# EAGLE design RoboCore Light sensor bar (EAGLE 9.6.2)
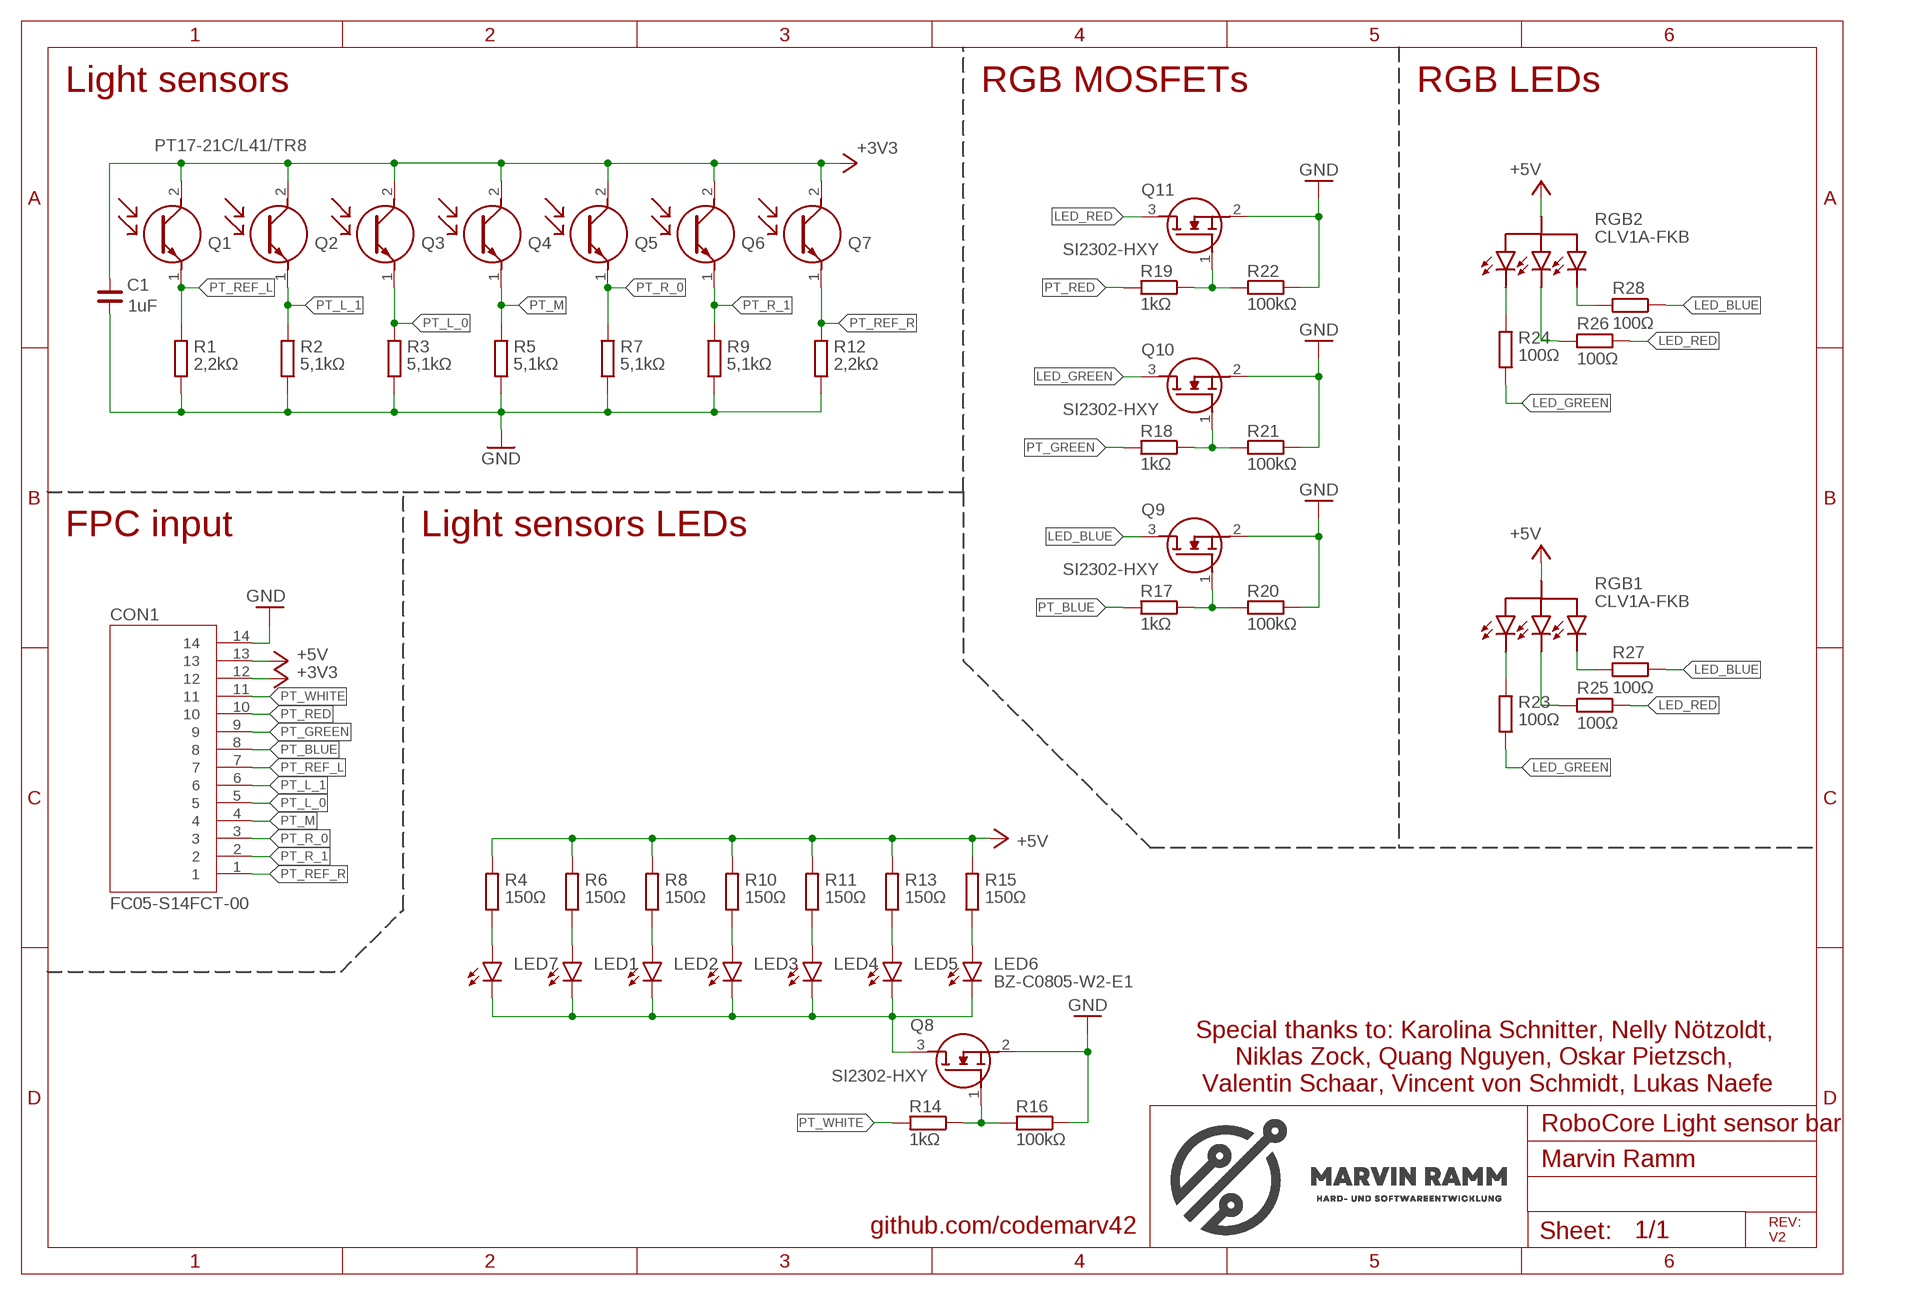
[diagram p0: schematic, sheet 1]

## Parts
C1  1uF  C_0402  [C0402]
CON1  FC05-S14FCT-00  [FC05-S14FCT-00]
LED1  LEDCHIP-LED0805  [CHIP-LED0805]
LED2  LEDCHIP-LED0805  [CHIP-LED0805]
LED3  LEDCHIP-LED0805  [CHIP-LED0805]
LED4  LEDCHIP-LED0805  [CHIP-LED0805]
LED5  LEDCHIP-LED0805  [CHIP-LED0805]
LED6  LEDCHIP-LED0805  [CHIP-LED0805]
LED7  LEDCHIP-LED0805  [CHIP-LED0805]
Q1  PT17-21C/L41/TR8  [0805]
Q2  PT17-21C/L41/TR8  [0805]
Q3  PT17-21C/L41/TR8  [0805]
Q4  PT17-21C/L41/TR8  [0805]
Q5  PT17-21C/L41/TR8  [0805]
Q6  PT17-21C/L41/TR8  [0805]
Q7  PT17-21C/L41/TR8  [0805]
Q8  SI2302DDS-T1-GE3  [SOT95P237X112-3N]
Q9  SI2302DDS-T1-GE3  [SOT95P237X112-3N]
Q10  SI2302DDS-T1-GE3  [SOT95P237X112-3N]
Q11  SI2302DDS-T1-GE3  [SOT95P237X112-3N]
R1  2,2kΩ  R_0402  [R0402]
R2  5,1kΩ  R_0402  [R0402]
R3  5,1kΩ  R_0402  [R0402]
R4  150Ω  R_0402  [R0402]
R5  5,1kΩ  R_0402  [R0402]
R6  150Ω  R_0402  [R0402]
R7  5,1kΩ  R_0402  [R0402]
R8  150Ω  R_0402  [R0402]
R9  5,1kΩ  R_0402  [R0402]
R10  150Ω  R_0402  [R0402]
R11  150Ω  R_0402  [R0402]
R12  2,2kΩ  R_0402  [R0402]
R13  150Ω  R_0402  [R0402]
R14  1kΩ  R_0402  [R0402]
R15  150Ω  R_0402  [R0402]
R16  100kΩ  R_0402  [R0402]
R17  1kΩ  R_0402  [R0402]
R18  1kΩ  R_0402  [R0402]
R19  1kΩ  R_0402  [R0402]
R20  100kΩ  R_0402  [R0402]
R21  100kΩ  R_0402  [R0402]
R22  100kΩ  R_0402  [R0402]
R23  100Ω  R_0402  [R0402]
R24  100Ω  R_0402  [R0402]
R25  100Ω  R_0402  [R0402]
R26  100Ω  R_0402  [R0402]
R27  100Ω  R_0402  [R0402]
R28  100Ω  R_0402  [R0402]
RGB1  RGBLED  [RGBLED]
RGB2  RGBLED  [RGBLED]

## Nets
+3V3: C1.2 CON1.12 Q1.2(C) Q2.2(C) Q3.2(C) Q4.2(C) Q5.2(C) Q6.2(C) Q7.2(C)
+5V: CON1.13 R4.1 R6.1 R8.1 R10.1 R11.1 R13.1 R15.1 RGB1.+5V RGB2.+5V
GND: C1.1 CON1.14 Q8.2(S) Q9.2(S) Q10.2(S) Q11.2(S) R1.2 R2.2 R3.2 R5.2 R7.2 R9.2 R12.2 R16.2 R20.2 R21.2 R22.2
LED_BLUE: Q9.3(D) R27.2 R28.2
LED_GREEN: Q10.3(D) R23.2 R24.2
LED_RED: Q11.3(D) R25.2 R26.2
N$1: LED1.C LED2.C LED3.C LED4.C LED5.C LED6.C LED7.C Q8.3(D)
N$2: LED7.A R4.2
N$3: Q11.1(G) R19.2 R22.1
N$4: Q10.1(G) R18.2 R21.1
N$5: Q9.1(G) R17.2 R20.1
N$14: LED5.A R13.2
N$15: LED6.A R15.2
N$17: Q8.1(G) R14.2 R16.1
N$18: LED4.A R11.2
N$45: R24.1 RGB2.P3
N$46: R28.1 RGB2.P1
N$47: R26.1 RGB2.P2
N$50: R23.1 RGB1.P3
N$51: R27.1 RGB1.P1
N$52: R25.1 RGB1.P2
N$53: LED3.A R10.2
N$54: LED2.A R8.2
N$55: LED1.A R6.2
PT_BLUE: CON1.8 R17.1
PT_GREEN: CON1.9 R18.1
PT_L_0: CON1.5 Q3.1(E) R3.1
PT_L_1: CON1.6 Q2.1(E) R2.1
PT_M: CON1.4 Q4.1(E) R5.1
PT_R_0: CON1.3 Q5.1(E) R7.1
PT_R_1: CON1.2 Q6.1(E) R9.1
PT_RED: CON1.10 R19.1
PT_REF_L: CON1.7 Q1.1(E) R1.1
PT_REF_R: CON1.1 Q7.1(E) R12.1
PT_WHITE: CON1.11 R14.1

## Notes on the sheet
- Light sensors | RGB MOSFETs | RGB LEDs
- RGB2
- SI2302-HXY | CLV1A-FKB
- SI2302-HXY
- FPC input | Light sensors LEDs
- SI2302-HXY
- RGB1
- CLV1A-FKB
- BZ-C0805-W2-E1
- Special thanks to: Karolina Schnitter, Nelly Nötzoldt, 
  Niklas Zock, Quang Nguyen, Oskar Pietzsch, 
  Valentin Schaar, Vincent von Schmidt, Lukas Naefe
- SI2302-HXY
- Marvin Ramm
- github.com/codemarv42
- REV:
  V2

## Library data of the parts
C1 = rc-master-smd:C_: NON-POLARIZED CAP
CON1 = FC05-S14FCT-00:FC05-S14FCT-00
LED1-LED7 = Led:LED: LED OSRAM: - CHIPLED LG R971, LG N971, LY N971, LG Q971, LY Q971, LO R971, LY R971 LH N974, LH R974 LS Q976, LO Q976, LY Q976 LO Q996 - Hyper CHIPLED LW Q18S LB Q993, LB Q99A, LB R99A - SideLED LS A670, LO A670, LY A670, LG A670, LP A670 LB A673, LV A673, LT A673, LW A673 LH A674 LY A675 LS A676, LA A676, LO A676, LY A676, LW A676 LS A679, LY A679, LG A679 - Hyper Micro SIDELED® LS Y876, LA Y876, LO Y876, LY Y876 LT Y87S - SmartLED LW L88C, LW L88S LB L89C, LB L89S, LG L890 LS L89K, LO L89K, LY L89K LS L896, LA L896, LO L896, LY L896 - TOPLED LS T670, LO T670, LY T670, LG T670, LP T670 LSG T670, LSP T670, LSY T670, LOP T670, LYG T670 LG T671, LOG T671, LSG T671 LB T673, LV T673, LT T673, LW T673 LH T674 LS T676, LA T676, LO T676, LY T676, LB T676, LH T676, LSB T676, LW T676 LB T67C, LV T67C, LT T67C, LS T67K, LO T67K, LY T67K, LW E67C LS E67B, LA E67B, LO E67B, LY E67B, LB E67C, LV E67C, LT E67C LW T67C LS T679, LY T679, LG T679 LS T770, LO T770, LY T770, LG T770, LP T770 LB T773, LV T773, LT T773, LW T773 LH T774 LS E675, LA E675, LY E675, LS T675 LS T776, LA T776, LO T776, LY T776, LB T776 LHGB T686 LT T68C, LB T68C - Hyper Mini TOPLED® LB M676 - Mini TOPLED Santana® LG M470 LS M47K, LO M47K, LY M47K Source: http://www.osram.convergy.de LUXEON: - LUMILED® LXK2-PW12-R00, LXK2-PW12-S00, LXK2-PW14-U00, LXK2-PW14-V00 LXK2-PM12-R00, LXK2-PM12-S00, LXK2-PM14-U00 LXK2-PE12-Q00, LXK2-PE12-R00, LXK2-PE12-S00, LXK2-PE14-T00, LXK2-PE14-U00 LXK2-PB12-K00, LXK2-PB12-L00, LXK2-PB12-M00, LXK2-PB14-N00, LXK2-PB14-P00, LXK2-PB14-Q00 LXK2-PR12-L00, LXK2-PR12-M00, LXK2-PR14-Q00, LXK2-PR14-R00 LXK2-PD12-Q00, LXK2-PD12-R00, LXK2-PD12-S00 LXK2-PH12-R00, LXK2-PH12-S00 LXK2-PL12-P00, LXK2-PL12-Q00, LXK2-PL12-R00 Source: www.luxeon.com KINGBRIGHT: KA-3528ASYC Source: www.kingbright.com
Q1-Q7 = Eigene Library:PT17-21C/L41/TR8
Q8-Q11 = SI2302DDS-T1-GE3:SI2302DDS-T1-GE3: SI2302DDS-T1-GE3 N-Channel MOSFET, 2.6 A, 20 V, 3-Pin SOT-363 Vishay Source: Datasheet <http://www.vishay.com/docs/63653/si2302dds.pdf>; ARROW_PART_NUMBER: SI2302DDS-T1-GE3; ARROW_PRICE-STOCK: https://www.arrow.com/en/products/si2302dds-t1-ge3/vishay; DESCRIPTION: SI2302DDS-T1-GE3 N-Channel MOSFET, 2.6 A, 20 V, 3-Pin SOT-363 Vishay; HEIGHT: 1.12mm; MANUFACTURER_NAME: Vishay; MANUFACTURER_PART_NUMBER: SI2302DDS-T1-GE3; MOUSER_PART_NUMBER: 78-SI2302DDS-T1-GE3; MOUSER_PRICE-STOCK: https://www.mouser.co.uk/ProductDetail/Vishay-Semiconductors/SI2302DDS-T1-GE3?qs=MxnWX8BLHKdaCSNWhg%252BxLA%3D%3D
R1-R28 = rc-master-smd:R_: RESISTOR
RGB1 RGB2 = RGB LED:RGBLED

## Board
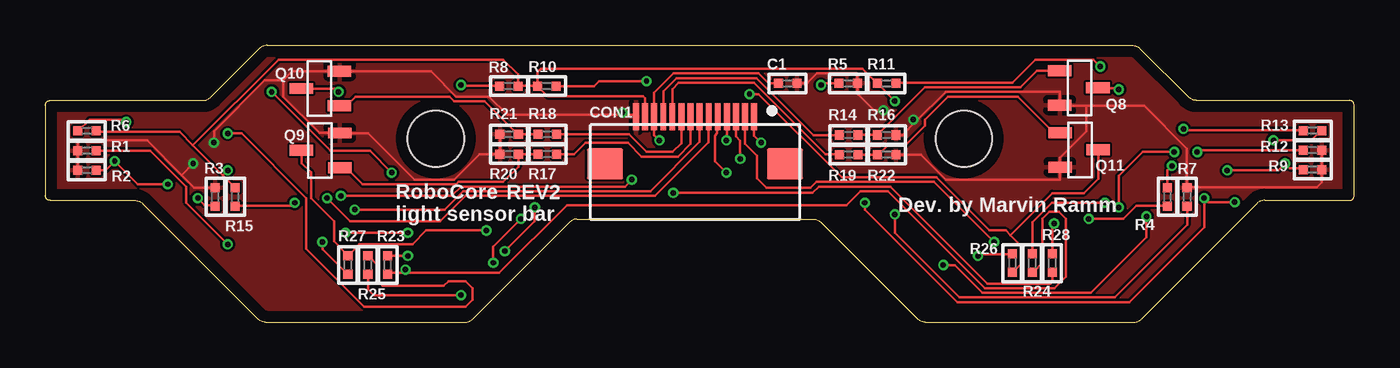
[diagram p1: board, top side]
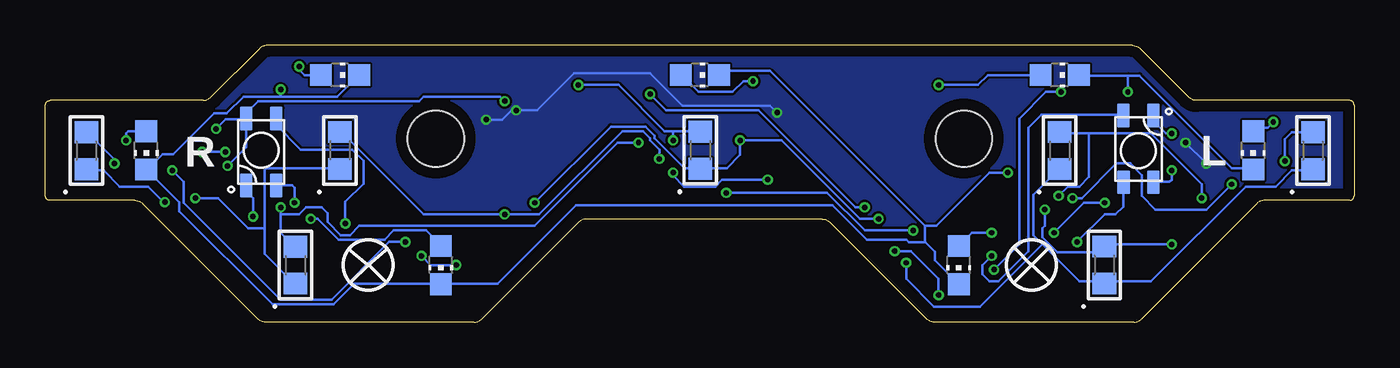
[diagram p2: board, bottom side, seen from below]

Size 72 x 15.23 mm. Coordinates in mm from the lower left corner, seen from the top.
Outline: 72,6.95 72,11.95 arc90 71.75,12.2 63.33,12.2 arc-45 62.9,12.38 60.23,15.05 arc45 59.8,15.23 12.2,15.23 arc37 11.82,15.1 9.1,12.38 arc-45 8.68,12.2 0.25,12.2 arc90 0,11.95 0,6.95 arc90 0.25,6.7 4.92,6.7 arc-45 5.35,6.52 11.7,0.17 arc45 12.12,0 23.07,0 arc45 23.5,0.17 28.82,5.5 arc-45 29.25,5.67 42.25,5.67 arc-45 42.67,5.5 48,0.17 arc45 48.42,0 59.88,0 arc45 60.3,0.17 66.65,6.52 arc-45 67.08,6.7 71.75,6.7 arc90 72,6.95
Copper layers (1*16): Top 0.035mm / dielectric 1.53mm / Bottom 0.035mm
Design rules "JLCPCB_1-2layer *": minimum track width 5mil, minimum drill 0.3mm, track to track 5mil, track to pad 0.2mm, pad to pad 7mil, via to via 7mil, smd to smd 7mil, copper to edge 25mil, drill to drill 6mil, minimum pad ring 6mil, minimum via ring 0.13mm, stop-mask expansion 0.1mm, vias tented up to drill 20mil, thermal gap 10mil
Holes 3.1 mm at 21.48,10.1 50.52,10.1

### Footprints (pad centres in the part's own frame; a part is rotated, then mirrored left to right if it is on the bottom)
C0402 = smd 0.5 x 0.5: 1 -0.508,0; 2 0.508,0
FC05-S14FCT-00 = smd 0.32 x 1.5: 1 2.51,-0.45; 2 3.01,-0.45; 3 3.51,-0.45; 4 4.01,-0.45; 5 4.51,-0.45; 6 5.01,-0.45; 7 5.51,-0.45; 8 6.01,-0.45; 9 6.51,-0.45; 10 7.01,-0.45; 11 7.51,-0.45; 12 8.01,-0.45; 13 8.51,-0.45; 14 9.01,-0.45 | smd 2 x 1.7: PAD1 0.81,2.15; PAD2 10.71,2.15
CHIP-LED0805 = smd 1.2 x 1.2: A 0,-1.05; C 0,1.05
0805 = smd 1.2 x 1.3: 1 -1.016,0; 2 1.016,0
SOT95P237X112-3N = smd 1.3 x 0.6: 1 -1.05,0.95; 2 -1.05,-0.95; 3 1.05,0
R0402 = smd 0.5 x 0.5: 1 -0.508,0; 2 0.508,0
RGBLED = smd 0.686 x 1.3: +5V -1.456,1.996; P1 0.184,1.996; P2 -1.458,-1.678; P3 0.192,-1.678

### Placement (x,y rotation side)
C1  40.83,13.14 180 top
CON1  41.5,10.86 180 top
LED1  5.55,9.45 180 bottom
LED2  16.2,13.6 270 bottom
LED3  36,13.6 270 bottom
LED4  55.8,13.6 270 bottom
LED5  66.45,9.45 180 bottom
LED6  21.75,3.15 180 bottom
LED7  50.25,3.15 180 bottom
Q1  13.74,3.15 270 bottom
Q2  2.27,9.44 270 bottom
Q3  16.2,9.45 270 bottom
Q4  35.97,9.46 270 bottom
Q5  55.8,9.45 270 bottom
Q6  69.75,9.44 270 bottom
Q7  58.24,3.14 270 bottom
Q8  56.85,12.89 0 top
Q9  15.14,9.46 180 top
Q10  15.13,12.86 180 top
Q11  56.87,9.48 0 top
R1  2.28,9.44 180 top
R2  2.28,8.36 180 top
R3  9.34,6.9 90 top
R4  61.73,6.9 270 top
R5  44.16,13.14 0 top
R6  2.28,10.53 180 top
R7  62.81,6.9 90 top
R8  25.5,12.99 180 top
R9  69.72,8.4 0 top
R10  27.59,12.99 0 top
R11  46.28,13.14 0 top
R12  69.72,9.47 0 top
R13  69.72,10.54 0 top
R14  44.19,10.3 0 top
R15  10.44,6.9 270 top
R16  46.29,10.3 0 top
R17  27.62,9.25 180 top
R18  27.62,10.34 180 top
R19  44.19,9.22 0 top
R20  25.51,9.25 180 top
R21  25.51,10.34 180 top
R22  46.29,9.22 0 top
R23  18.83,3.15 270 top
R24  54.29,3.25 270 top
R25  17.74,3.15 270 top
R26  53.2,3.25 270 top
R27  16.64,3.15 90 top
R28  55.39,3.25 270 top
RGB1  12.49,9.7 180 bottom
RGB2  59.49,9.2 0 bottom

### Tracks (layer width: path | path; a pad name or v marks a point on that pad's centre or on a via)
+3V3  (via drill 0.3)
  Top 0.127: C1.2 39.78,13.15 39.24,13.69 34.55,13.69 33.49,12.63 CON1.12 33.49,10.3 v33.78,10 | v65.43,6.61 63.97,6.61 v63.75,6.83 63.75,5.23 59.64,1.11 50.16,1.11 45.09,6.19 v45.09,6.58 | v24.64,3.27 24.64,4.16 v26.16,5.69
  Bottom 0.127: 17.14,4.29 17.65,4.8 17.65,7 16.23,8.43 Q3.2 | 17.14,4.29 15.11,2.26 13.84,2.26 Q1.2 13.72,2.26 11.18,2.26 5.97,7.46 4.32,7.46 3.43,8.35 2.29,8.35 Q2.2 | 59.94,5.18 59.94,3.77 58.31,2.13 Q7.2 | 59.94,5.18 59.94,8.36 59.82,8.48 55.88,8.48 Q5.2 | v65.43,6.61 65.5,6.61 66.35,7.46 67.91,7.46 68.8,8.35 69.72,8.35 Q6.2 | v63.75,6.83 62.48,6.83 60.83,5.18 59.94,5.18 | v45.09,6.58 40.89,10.77 38.99,10.77 38.48,10.26 38.48,10.13 36.83,8.48 36.07,8.48 Q4.2 35.94,8.48 34.51,8.48 33.78,9.2 v33.78,10 31.5,10 27.18,5.69 v26.16,5.69 | 17.14,4.29 20.57,0.86 23.11,0.86 24.64,2.38 v24.64,3.27
+5V  (via drill 0.3)
  Top 0.127: v61.98,8.61 61.73,8.36 R4.1 | v62.61,10.64 62.69,10.56 69.1,10.56 69.09,10.54 R13.1 | 8.11,9.73 7.37,10.48 2.83,10.48 2.79,10.51 R6.1 | 9.76,8.09 8.11,9.73 | R15.1 9.76,8.08 9.76,8.09 | 9.76,8.09 v10.03,8.35 | R10.1 R8.1 26.01,13.63 25.19,14.45 12.83,14.45 8.11,9.73 | R10.1 27.08,13.77 27.26,13.94 44.96,13.94 45.72,13.18 R11.1 45.85,13.05 v46.74,12.16 | R10.1 27.08,12.98 27.61,12.45 32.88,12.45 32.99,12.33 CON1.13
  Bottom 0.127: v61.98,8.61 60.96,9.62 60.96,10.64 | 60.96,10.64 60.96,11.15 RGB2.+5V | v62.61,10.64 62.08,11.17 60.95,11.17 | 60.96,10.64 60.95,11.17 | 60.95,11.17 RGB2.+5V | v10.03,8.35 10.03,7.84 10.15,7.72 10.92,7.72 RGB1.+5V | RGB2.+5V 60.95,11.52 60.3,12.16 51.44,12.16 51.18,12.42 46.99,12.42 v46.74,12.16
GND  (via drill 0.3)
  Top 0.127: R22.2 48.16,9.22 49.53,7.84 55.82,7.84 Q11.2 55.82,9.06 57.27,10.51 57.27,11.91 | R12.2 70.23,9.37 70.23,8.48 R9.2 70.23,7.69 69.96,7.42 62.88,7.42 62.87,7.41 R7.2 62.81,9.55 60.45,11.91 57.27,11.91 | C1.1 41.91,13.14 42.46,13.69 44.63,13.69 44.67,13.65 R5.2 44.67,12.57 45.58,11.66 v46.1,11.66 | R16.2 47.16,10.3 47.88,11.02 | 47.88,11.02 49.53,12.67 55.8,12.67 Q8.2 55.88,11.91 57.27,11.91 | 47.88,11.02 v47.75,11.15 | R2.2 1.77,8.38 1.77,9.43 R1.2 1.77,9.88 1.89,10 5.59,10 7.49,8.1 | R3.2 8.18,7.41 7.49,8.1 | R21.2 25.02,10.26 25.02,9.37 R20.2 24.89,9.24 23.88,9.24 22.48,7.84 20.32,7.84 17.76,10.41 Q9.2 15.08,10.42 13.08,12.42 13.08,13.31 | 13.08,13.31 13.58,13.8 Q10.2 21.22,13.81 22.61,12.42 24.42,12.42 25.44,11.4 31.75,11.4 | 31.75,11.4 32.38,11.4 CON1.14 | v8.13,8.73 7.49,8.1 | v9.27,9.88 9.27,10.51 12.06,13.31 13.08,13.31 | 31.75,11.4 v31.75,11.53
  Bottom 0.127: v47.75,11.15 46.86,11.15 46.35,11.66 v46.1,11.66 44.96,11.66 42.93,13.69 38.73,13.69 36.96,11.91 32.13,11.91 v31.75,11.53 | v9.27,9.88 v8.13,8.73
  pour Top: 0,11.75 0,15.25 14.35,15.25 72,15.25 72,8.85 72,0 15.45,0 0,0
  pour Bottom: 0,11.55 0,15.25 15,15.25 72,15.25 72,10.1 72,0 15.25,0 0,0
LED_BLUE  (via drill 0.3)
  Top 0.127: Q9.3 14.09,8.76 14.61,8.25 14.61,6.83 15.88,5.56 15.88,4.45 16.64,3.68 R27.2 16.76,3.78 17.27,4.29 20.19,4.29 20.95,5.05 v24.26,5.05 | R28.2 55.39,2.22 55.3,2.13 51.82,2.13 46.48,7.46 42.55,7.46 42.2,7.12 v34.55,7.12
  Bottom 0.127: v34.55,7.12 28.99,7.12 26.92,5.05 v24.26,5.05
LED_GREEN  (via drill 0.3)
  Top 0.127: R23.2 18.93,2.74 19.81,2.74 | R24.2 54.36,2.76 54.86,3.27 54.86,5.69 55.24,6.07 55.75,6.07 56.13,5.69 56.13,2.51 55.5,1.88 51.69,1.88 46.35,7.21 44.83,7.21 44.07,6.45 28.7,6.45 24.97,2.72 19.81,2.72 19.81,2.74 | v16.13,12.67 15.95,12.86 Q10.3 | 19.81,2.74 v19.81,2.89
  Bottom 0.127: v16.13,12.67 16.95,12.67 18.41,11.21 18.41,4.29 v19.81,2.89
LED_RED  (via drill 0.3)
  Top 0.127: v22.86,1.5 18.06,1.5 17.74,1.81 R25.2 | v25.27,3.91 26.92,5.56 v26.92,6.32 | v38.73,12.54 39.24,12.54 43.81,7.97 49.02,7.97 51.94,5.05 52.83,5.05 53.09,4.8 | 53.09,4.8 53.72,4.16 53.72,3.24 53.22,2.74 R26.2 | 53.09,4.8 55.4,7.11 57.12,7.11 57.92,7.91 Q11.3
  Bottom 0.127: v22.86,1.5 22.86,2.38 24.38,3.91 v25.27,3.91 | v26.92,6.32 27.43,6.32 32.77,11.66 37.85,11.66 v38.73,12.54
N$1  (via drill 0.3)
  Top 0.127: v59.05,12.8 58.97,12.89 Q8.3 | v12.45,12.67 15.69,9.43 17.85,9.43 v19.05,8.23
  Bottom 0.127: 66.4,8.35 64.64,6.59 64.64,6.12 59.51,0.99 56.13,0.99 55,2.12 50.27,2.12 LED7.C 50.16,2.13 47.12,2.13 42.8,6.45 28.7,6.45 26.8,4.54 24.64,4.54 24.5,4.41 23.62,4.41 | 66.4,8.35 66.42,8.35 LED5.C 66.41,8.4 | 66.4,8.35 65.91,8.35 66.41,8.4 | 59.05,12.42 61.1,12.42 62.02,11.5 62.73,11.5 64.98,9.25 65.56,9.25 66.41,8.4 | 59.05,12.42 55.95,12.42 54.77,13.59 LED4.C | 59.05,12.42 v59.05,12.8 | 12.45,13.56 15.11,13.56 LED2.C | 12.45,13.56 11.81,13.56 6.73,8.48 5.59,8.48 LED1.C | 23.62,5.31 23.62,4.41 | 23.62,5.31 32.15,13.83 34.72,13.83 LED3.C | LED6.C 21.77,2.1 23.07,3.4 23.07,3.89 23.59,4.41 23.62,4.41 | v12.45,12.67 12.45,13.56 | v19.05,8.23 20.07,8.23 22.99,5.31 23.62,5.31
N$2  (via drill 0.3)
  Top 0.127: R4.2 60.02,6.4 59.31,5.69 v57.4,5.69
  Bottom 0.127: v57.4,5.69 57.02,5.69 55.88,4.54 53.34,4.54 52.83,5.05 51.06,5.05 50.28,4.27 LED7.A
N$3
  Top 0.127: R19.2 R22.1 45.85,9.24 46.35,9.75 47.32,9.75 48.39,10.82 48.39,11.15 49.66,12.42 53.49,12.42 55.48,10.43 Q11.1
N$4
  Top 0.127: R18.2 R21.1 25.96,10.36 24.16,12.16 22.48,12.16 22.23,12.42 17.07,12.42 16.55,11.91 Q10.1
N$5
  Top 0.127: R17.2 27.09,9.25 R20.1 26.02,8.56 25.18,7.72 22.73,7.72 22.61,7.59 17.45,7.59 16.54,8.51 Q9.1
N$14  (via drill 0.3)
  Top 0.127: v67.56,10 69.65,10 70.17,10.53 R13.2
  Bottom 0.127: LED5.A 67.45,10.5 67.56,10.39 v67.56,10
N$15  (via drill 0.3)
  Top 0.127: v13.72,6.58 13.54,6.4 10.45,6.4 R15.2 | v19.94,4.92 v16.51,4.92
  Bottom 0.127: v13.72,6.58 14.86,6.58 v16.51,4.92 | v19.94,4.92 21.03,4.92 LED6.A
N$17
  Top 0.127: R14.2 R16.1 45.85,10.39 48.39,12.93 53.64,12.93 54.56,13.84 Q8.1
N$18  (via drill 0.3)
  Top 0.127: v58.04,14.07 57.66,14.45 54.46,14.45 53.19,13.18 46.86,13.18 R11.2
  Bottom 0.127: v58.04,14.07 58.04,13.9 57.74,13.6 LED4.A
N$45  (via drill 0.3)
  Top 0.127: v58.29,6.58 55.37,6.58 54.29,5.49 R24.1
  Bottom 0.127: 59.32,7.55 58.43,7.55 58.29,7.41 v58.29,6.58 | 59.34,7.55 59.32,7.55 | 59.32,7.55 RGB2.P3
N$46  (via drill 0.3)
  Top 0.127: v55.5,5.43 55.4,5.33 R28.1
  Bottom 0.127: v55.5,5.43 55.5,6.63 54.51,7.62 54.51,8.89 55.12,9.5 57.95,9.5 59.31,10.85 RGB2.P1
N$47  (via drill 0.3)
  Top 0.127: v51.31,3.65 51.4,3.75 R26.1 | v49.4,3.15 50.04,3.15 51.56,1.62 57.52,1.62 60.58,4.68 v60.58,5.81
  Bottom 0.127: v51.31,3.65 50.8,3.15 v49.4,3.15 | v60.58,5.81 60.58,6.83 60.95,7.2 RGB2.P2
N$50  (via drill 0.3)
  Top 0.127: v19.94,3.65 18.92,3.65 R23.1
  Bottom 0.127: v19.94,3.65 20.45,3.15 20.45,2.64 20.07,2.26 19.56,2.26 17.91,3.91 17.91,10.7 17.2,11.4 12.7,11.4 RGB1.P3
N$51  (via drill 0.3)
  Top 0.127: R27.1 16.62,2.64 15.24,4.02 v15.24,4.42
  Bottom 0.127: v15.24,4.42 13.72,5.94 13.12,5.94 12.7,6.36 12.7,7.59 RGB1.P1
N$52  (via drill 0.3)
  Top 0.127: v10.03,10.39 10.79,10.39 14.35,6.83 14.35,4.04 17.53,0.86 23.11,0.86 23.5,1.24 23.5,1.88 23.11,2.27 22.18,2.27 21.91,2 18.54,2 18.29,2.26 18.29,3.15 17.78,3.65 R25.1
  Bottom 0.127: RGB1.P2 11.04,11.06 10.36,10.39 v10.03,10.39
N$53  (via drill 0.3)
  Top 0.127: v33.07,13.26 30.45,13.26 30.17,12.99 R10.2
  Bottom 0.127: v33.07,13.26 33.6,13.26 34.19,12.67 36.07,12.67 36.96,13.56 LED3.A
N$54  (via drill 0.3)
  Top 0.127: v22.86,13.05 22.91,13 24.98,13 R8.2
  Bottom 0.127: v22.86,13.05 20.7,13.05 20.15,13.6 LED2.A
N$55  (via drill 0.3)
  Top 0.127: R6.2 1.81,10.53 2.43,11.15 4.32,11.15 v4.45,11.02
  Bottom 0.127: v4.45,11.02 4.75,10.71 5.33,10.71 LED1.A
PT_BLUE
  Top 0.127: CON1.8 35.5,9.81 34.81,9.11 32.81,9.11 32.05,9.88 29.72,9.88 29.1,9.25 R17.1
PT_GREEN
  Top 0.127: CON1.9 34.99,9.86 34.5,9.37 33.07,9.37 32.1,10.34 R18.1
PT_L_0  (via drill 0.3)
  Top 0.127: v8.38,6.83 8.76,6.45 9.27,6.45 R3.1 | v37.47,8.23 36.83,8.86 36.83,10.26 36.96,10.39 36.96,11.27 CON1.5 | v32.26,7.84 31.88,7.46 22.86,7.46 22.35,6.96 v16.26,6.96
  Bottom 0.127: v8.38,6.83 8.38,7.59 11.18,10.39 14.59,10.39 | 14.59,10.39 16.13,10.39 Q3.1 | v37.47,8.23 37.47,8.07 36.85,7.46 35.15,7.46 34.76,7.84 v32.26,7.84 | v16.26,6.96 15.75,7.46 15.12,7.46 14.59,7.99 14.59,10.39
PT_L_1  (via drill 0.3)
  Top 0.127: R2.1 3.31,8.36 v3.81,8.86 5.08,7.59 v6.73,7.59 | v15.49,6.83 16.76,5.56 21.72,5.56 23.11,6.96 33.54,6.96 36.48,9.89 CON1.6
  Bottom 0.127: v3.81,8.86 3.81,10.06 3.41,10.46 Q2.1 | v15.49,6.83 14.99,6.83 13.08,8.73 12.32,8.73 11.68,8.1 11.68,6.96 10.92,6.19 8.13,6.19 v6.73,7.59
PT_M  (via drill 0.3)
  Top 0.127: v42.67,13.05 42.77,13.15 R5.1 | v37.47,10 37.49,10.03 CON1.4
  Bottom 0.127: v42.67,13.05 40.47,13.05 37.93,10.51 37.47,10.51 | 37.47,10.51 36.07,10.51 Q4.1 | 37.47,10.51 v37.47,10
PT_R_0  (via drill 0.3)
  Top 0.127: R7.1 62.81,5.36 58.83,1.37 50.29,1.37 46.74,4.92 v46.74,5.94 | v38.23,8.99 38.23,9.99 37.99,10.23 CON1.3
  Bottom 0.127: Q5.1 55.75,10.51 51.18,5.94 v46.74,5.94 44.83,5.94 40.26,10.51 39.12,10.51 38.73,10.13 38.73,10 38.23,9.5 v38.23,8.99
PT_R_1  (via drill 0.3)
  Top 0.127: R9.1 69.09,8.48 68.45,8.48 v68.2,8.73 67.82,8.35 v65.02,8.35 | v52.2,4.42 48.9,7.72 42.42,7.72 42.09,7.39 39.67,7.39 39.14,7.92 39.14,9.15 38.48,9.81 38.48,11.27 CON1.2
  Bottom 0.127: Q6.1 69.7,10.46 68.2,8.95 v68.2,8.73 | v52.2,4.42 53.09,4.42 56.26,1.24 59.05,1.24 64.39,6.58 64.39,7.72 v65.02,8.35
PT_RED
  Top 0.127: CON1.10 34.49,12.83 34.84,13.18 38.99,13.18 42.93,9.24 43.56,9.24 R19.1
PT_REF_L  (via drill 0.3)
  Top 0.127: v10.03,4.29 7.75,6.58 7.75,7.46 5.77,9.44 R1.1 | CON1.7 36,9.92 33.29,7.21 22.99,7.21 21.97,6.19 v17.02,6.19
  Bottom 0.127: v10.03,4.29 13.72,4.29 Q1.1 13.84,4.16 14.16,3.84 16.32,3.84 17.14,4.67 17.14,5.18 17.02,5.31 v17.02,6.19
PT_REF_R  (via drill 0.3)
  Top 0.127: R12.1 69.19,9.45 63.45,9.45 v63.37,9.37 | v62.1,9.37 60.37,9.37 59.05,8.05 v59.05,6.32 | v39.37,9.88 38.99,10.25 CON1.1
  Bottom 0.127: v62.1,9.37 v63.37,9.37 | 59.05,5.94 59.05,4.92 58.29,4.16 Q7.1 | 59.05,5.94 v59.05,6.32 | v39.37,9.88 40.51,9.88 45.09,5.31 54.74,5.31 55.24,4.8 55.75,4.8 56.48,5.53 56.48,5.99 56.82,6.32 57.66,6.32 58.04,5.94 59.05,5.94
PT_WHITE
  Top 0.127: R14.1 42.26,10.29 39.12,13.43 34.72,13.43 34,12.71 CON1.11

### Text on the board
tPlace: REV2 | Dev. by Marvin Ramm | RoboCore / light sensor bar
bPlace: L | R